# Altium schematic sheet 9V Power.SchDoc
size A4; SheetNumber: 5; SheetTotal: 6
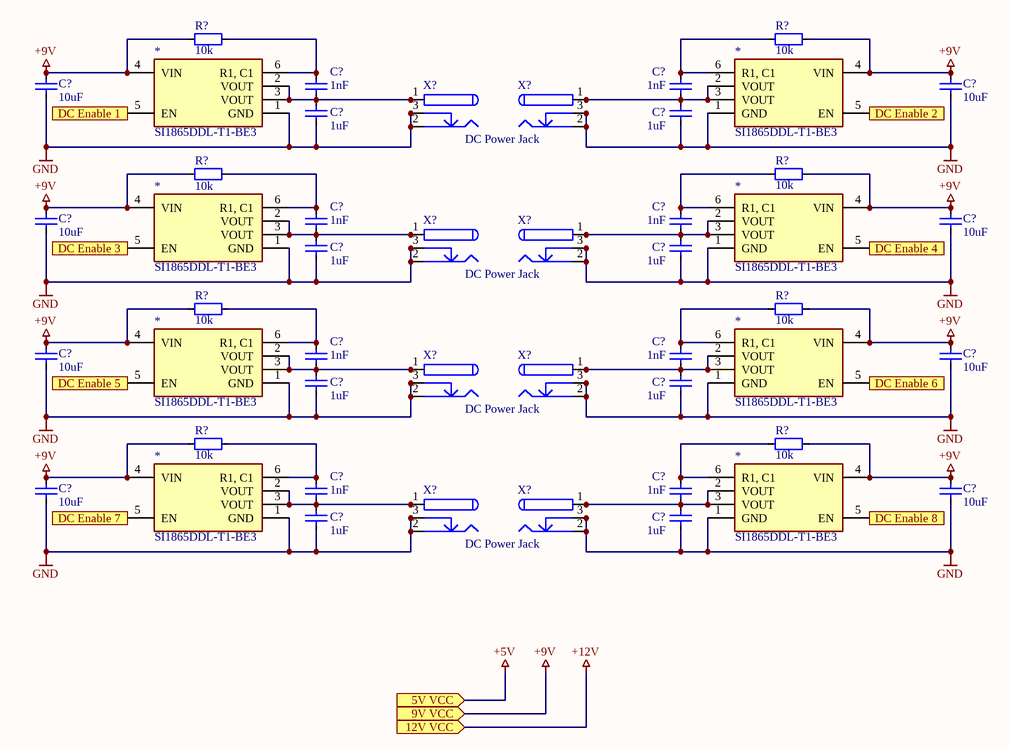
[diagram p0: 9V Power.SchDoc]

## Parts
(Parts that share a designator on the sheet are numbered #1, #2 ... from top to bottom, then left to right.)
*#1  SI1865DDL-T1-BE3  [SOT-363]
*#2  SI1865DDL-T1-BE3  [SOT-363]
*#3  SI1865DDL-T1-BE3  [SOT-363]
*#4  SI1865DDL-T1-BE3  [SOT-363]
*#5  SI1865DDL-T1-BE3  [SOT-363]
*#6  SI1865DDL-T1-BE3  [SOT-363]
*#7  SI1865DDL-T1-BE3  [SOT-363]
*#8  SI1865DDL-T1-BE3  [SOT-363]
C?#1  value 10uF  [CAP CER 0402 R]  (hidden comment: Capacitor)
C?#2  value 1nF  [CAP CER 0402 R]  (hidden comment: Capacitor)
C?#3  value 1nF  [CAP CER 0402 R]  (hidden comment: Capacitor)
C?#4  value 10uF  [CAP CER 0402 R]  (hidden comment: Capacitor)
C?#5  value 1uF  [CAP CER 0402 R]  (hidden comment: Capacitor)
C?#6  value 1uF  [CAP CER 0402 R]  (hidden comment: Capacitor)
C?#7  value 10uF  [CAP CER 0402 R]  (hidden comment: Capacitor)
C?#8  value 1nF  [CAP CER 0402 R]  (hidden comment: Capacitor)
C?#9  value 1nF  [CAP CER 0402 R]  (hidden comment: Capacitor)
C?#10  value 10uF  [CAP CER 0402 R]  (hidden comment: Capacitor)
C?#11  value 1uF  [CAP CER 0402 R]  (hidden comment: Capacitor)
C?#12  value 1uF  [CAP CER 0402 R]  (hidden comment: Capacitor)
C?#13  value 10uF  [CAP CER 0402 R]  (hidden comment: Capacitor)
C?#14  value 1nF  [CAP CER 0402 R]  (hidden comment: Capacitor)
C?#15  value 1nF  [CAP CER 0402 R]  (hidden comment: Capacitor)
C?#16  value 10uF  [CAP CER 0402 R]  (hidden comment: Capacitor)
C?#17  value 1uF  [CAP CER 0402 R]  (hidden comment: Capacitor)
C?#18  value 1uF  [CAP CER 0402 R]  (hidden comment: Capacitor)
C?#19  value 10uF  [CAP CER 0402 R]  (hidden comment: Capacitor)
C?#20  value 10uF  [CAP CER 0402 R]  (hidden comment: Capacitor)
C?#21  value 1nF  [CAP CER 0402 R]  (hidden comment: Capacitor)
C?#22  value 1nF  [CAP CER 0402 R]  (hidden comment: Capacitor)
C?#23  value 1uF  [CAP CER 0402 R]  (hidden comment: Capacitor)
C?#24  value 1uF  [CAP CER 0402 R]  (hidden comment: Capacitor)
R?#1  value 10k  [RES 0402 R]  (hidden comment: Resistor)
R?#2  value 10k  [RES 0402 R]  (hidden comment: Resistor)
R?#3  value 10k  [RES 0402 R]  (hidden comment: Resistor)
R?#4  value 10k  [RES 0402 R]  (hidden comment: Resistor)
R?#5  value 10k  [RES 0402 R]  (hidden comment: Resistor)
R?#6  value 10k  [RES 0402 R]  (hidden comment: Resistor)
R?#7  value 10k  [RES 0402 R]  (hidden comment: Resistor)
R?#8  value 10k  [RES 0402 R]  (hidden comment: Resistor)
X?#1  DC Power Jack
X?#2  DC Power Jack  (value not drawn)
X?#3  DC Power Jack
X?#4  DC Power Jack  (value not drawn)
X?#5  DC Power Jack
X?#6  DC Power Jack  (value not drawn)
X?#7  DC Power Jack
X?#8  DC Power Jack  (value not drawn)

## Ports
5V VCC (in), 9V VCC (in), 12V VCC (in), DC Enable 1 (in), DC Enable 2 (in), DC Enable 3 (in), DC Enable 4 (in), DC Enable 5 (in), DC Enable 6 (in), DC Enable 7 (in), DC Enable 8 (in)

## Nets
+5V: port 5V VCC
+9V: *#1.4(VIN) *#2.4(VIN) *#3.4(VIN) *#4.4(VIN) *#5.4(VIN) *#6.4(VIN) *#7.4(VIN) *#8.4(VIN) C?#1.2 C?#4.2 C?#7.2 C?#10.2 C?#13.2 C?#16.2 C?#19.1 C?#20.2 R?#1.2 R?#2.2 R?#3.2 R?#4.1 R?#5.2 R?#6.1 R?#7.2 R?#8.1 ; port 9V VCC
+12V: port 12V VCC
GND: *#1.1(GND) *#2.1(GND) *#3.1(GND) *#4.1(GND) *#5.1(GND) *#6.1(GND) *#7.1(GND) *#8.1(GND) C?#1.1 C?#4.1 C?#5.1 C?#6.1 C?#7.1 C?#10.1 C?#11.1 C?#12.1 C?#13.1 C?#16.1 C?#17.1 C?#18.1 C?#19.2 C?#20.1 C?#23.1 C?#24.1 X?#1.2 X?#1.2A X?#1.2B X?#1.3 X?#1.3A X?#1.3B X?#2.2 X?#2.2A X?#2.2B X?#2.3 X?#2.3A X?#2.3B X?#3.2 X?#3.2A X?#3.2B X?#3.3 X?#3.3A X?#3.3B X?#4.2 X?#4.2A X?#4.2B X?#4.3 X?#4.3A X?#4.3B X?#5.2 X?#5.2A X?#5.2B X?#5.3 X?#5.3A X?#5.3B X?#6.2 X?#6.2A X?#6.2B X?#6.3 X?#6.3A X?#6.3B X?#7.2 X?#7.2A X?#7.2B X?#7.3 X?#7.3A X?#7.3B X?#8.2 X?#8.2A X?#8.2B X?#8.3 X?#8.3A X?#8.3B
DC Enable 1: *#1.5(EN) ; port DC Enable 1
DC Enable 2: *#2.5(EN) ; port DC Enable 2
DC Enable 3: *#3.5(EN) ; port DC Enable 3
DC Enable 4: *#4.5(EN) ; port DC Enable 4
DC Enable 5: *#5.5(EN) ; port DC Enable 5
DC Enable 6: *#6.5(EN) ; port DC Enable 6
DC Enable 7: *#7.5(EN) ; port DC Enable 7
DC Enable 8: *#8.5(EN) ; port DC Enable 8
Net*#1_2: *#1.2(VOUT) *#1.3(VOUT) C?#2.1 C?#5.2 X?#1.1 X?#1.1A X?#1.1B
Net*#1_6: *#1.6(R1,_C1) C?#2.2 R?#1.1
Net*#2_2: *#2.2(VOUT) *#2.3(VOUT) C?#3.1 C?#6.2 X?#2.1 X?#2.1A X?#2.1B
Net*#2_6: *#2.6(R1,_C1) C?#3.2 R?#2.1
Net*#3_2: *#3.2(VOUT) *#3.3(VOUT) C?#8.1 C?#11.2 X?#3.1 X?#3.1A X?#3.1B
Net*#3_6: *#3.6(R1,_C1) C?#8.2 R?#3.1
Net*#4_2: *#4.2(VOUT) *#4.3(VOUT) C?#9.1 C?#12.2 X?#4.1 X?#4.1A X?#4.1B
Net*#4_6: *#4.6(R1,_C1) C?#9.2 R?#4.2
Net*#5_2: *#5.2(VOUT) *#5.3(VOUT) C?#14.1 C?#17.2 X?#5.1 X?#5.1A X?#5.1B
Net*#5_6: *#5.6(R1,_C1) C?#14.2 R?#5.1
Net*#6_2: *#6.2(VOUT) *#6.3(VOUT) C?#15.1 C?#18.2 X?#6.1 X?#6.1A X?#6.1B
Net*#6_6: *#6.6(R1,_C1) C?#15.2 R?#6.2
Net*#7_2: *#7.2(VOUT) *#7.3(VOUT) C?#21.1 C?#23.2 X?#7.1 X?#7.1A X?#7.1B
Net*#7_6: *#7.6(R1,_C1) C?#21.2 R?#7.1
Net*#8_2: *#8.2(VOUT) *#8.3(VOUT) C?#22.1 C?#24.2 X?#8.1 X?#8.1A X?#8.1B
Net*#8_6: *#8.6(R1,_C1) C?#22.2 R?#8.2

## Notes on the sheet
- Bahnhöheweg 70
- ICT Berufsbildungscenter AG
- Bereich Elektronik
- Datum:
- Version:
- Blattgrösse:
- Blattnummer:
- A4
- /
- 3018 Bern
- Dateiname:

## Library data of the parts
C?#1-C?#24 = Capacitor: Non polarized capacitor; LatestRevisionDate: 01.04.2019; Publisher: ICT Berufsbildungscenter AG
X?#1-X?#8 = DC Power Jack: DC Power Jack 9V
R?#1-R?#8 = Resistor: LatestRevisionDate: 02.04.2019; Publisher: ICT Berufsbildungscenter AG